# EAGLE schematic USB_to_MBUS (EAGLE 9.6.2)
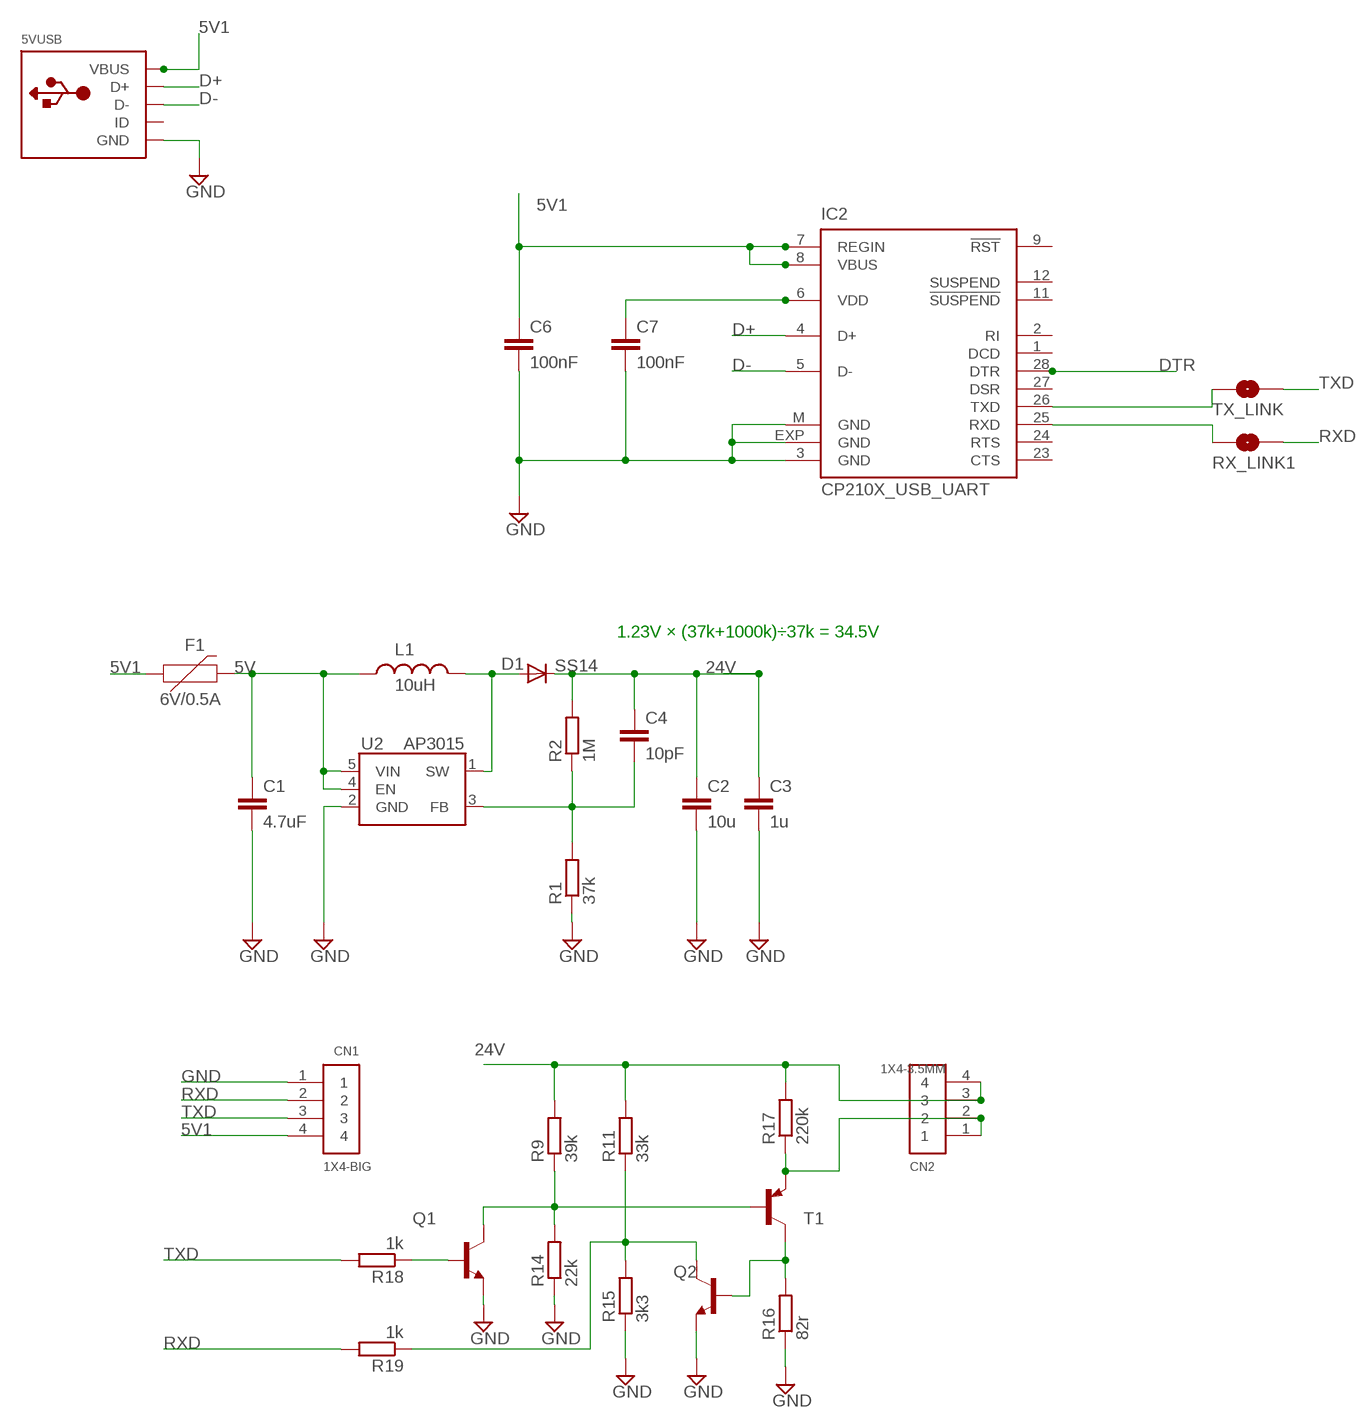
[diagram p0: schematic, sheet 1]

## Parts
5VUSB  USBMOLEX  [USB-MINIB-THM-MOLEX]
C1  4.7uF  1.0UF-0603-16V-10%  [0603]
C2  10u  1.0UF-1206-50V-10%  [1206]
C3  1u  1.0UF-1206-50V-10%  [1206]
C4  10pF  CAP0603-CAP  [0603-CAP]
C6  100nF  CAP0603-CAP  [0603-CAP]
C7  100nF  CAP0603-CAP  [0603-CAP]
CN1  1X4-BIG  [1X04-BIG]
CN2  1X4-3.5MM  [1X04-3.5MM]
D1  SS14  DIODESOD-123  [SOD-123]
F1  6V/0.5A  PPTC_HALF-AMP  [1206]
IC2  CP210X_USB_UART  [MLP28]
L1  10uH  INDUCTORCR54  [CR54]
Q1  BC808-NPN-SOT23-BEC  [SOT23-BEC]
Q2  BC808-NPN-SOT23-BEC  [SOT23-BEC]
R1  37k  R-EU_R0603  [R0603]
R2  1M  R-EU_R0603  [R0603]
R9  39k  R-EU_R0603  [R0603]
R11  33k  R-EU_R0603  [R0603]
R14  22k  R-EU_R0603  [R0603]
R15  3k3  R-EU_R0603  [R0603]
R16  82r  R-EU_R0603  [R0603]
R17  220k  R-EU_R0603  [R0603]
R18  1k  R-EU_R0603  [R0603]
R19  1k  R-EU_R0603  [R0603]
RX_LINK1  SOLDERJUMPERNC  [SJ_2S]
T1  BC807-16-PNP-SOT23-BEC  [SOT23-BEC]
TX_LINK  SOLDERJUMPERNC  [SJ_2S]
U2  AP3015  [SOT-23-5]

## Nets
5V: C1.1 F1.2 L1.P$1 U2.4(EN) U2.5(VIN)
5V1 [power]: 5VUSB.VBUS C6.1 CN1.4 F1.1 IC2.7(REGIN) IC2.8(VBUS)
24V: C2.1 C3.1 C4.1 CN2.3 CN2.4 D1.C R2.2 R9.2 R11.2 R17.2
D+: 5VUSB.D+ IC2.4(D+)
D-: 5VUSB.D- IC2.5(D-)
DTR: IC2.28(DTR)
GND [power]: 5VUSB.GND C1.2 C2.2 C3.2 C6.2 C7.2 CN1.1 IC2.3(GND) IC2.EXP(GND) IC2.M(GND) Q1.E Q2.E R1.1 R14.1 R15.1 R16.1 U2.2(GND)
N$1: C7.1 IC2.6(VDD)
N$4: C4.2 R1.2 R2.1 U2.3(FB)
N$5: D1.A L1.P$2 U2.1(SW)
N$10: IC2.26(TXD) TX_LINK.1
N$11: IC2.25(RXD) RX_LINK1.1
N$13: CN2.1 CN2.2 R17.1 T1.E
N$16: Q2.B R16.2 T1.C
N$18: Q1.C R9.1 R14.2 T1.B
N$21: Q2.C R11.1 R15.2 R19.1
N$25: Q1.B R18.1
RXD: CN1.2 R19.2 RX_LINK1.2
TXD: CN1.3 R18.2 TX_LINK.2
Unconnected: 5VUSB.ID IC2.1(DCD) IC2.2(RI) IC2.9(!RST) IC2.11(!SUSPEND) IC2.12(SUSPEND) IC2.23(CTS) IC2.24(RTS) IC2.27(DSR)

## Notes on the sheet
- 1.23V × (37k+1000k)÷37k = 34.5V

## Library data of the parts
5VUSB = adafruit:USB: USB Connectors USBMINIB - Surface Mount Female Mini-B USB Connector 4UConnector: 06564 By microbuilder.eu Thru-hole RA Female Mini-B USB Connector 4UConnector: 18732 By ladyada.net
C1 = SparkFun-Capacitors:1.0UF: 1µF ceramic capacitors A capacitor is a passive two-terminal electrical component used to store electrical energy temporarily in an electric field.; PROD_ID: CAP-00868; VALUE: 1.0uF
C2 C3 = SparkFun-Capacitors:1.0UF: 1µF ceramic capacitors A capacitor is a passive two-terminal electrical component used to store electrical energy temporarily in an electric field.; PROD_ID: CAP-09822; VALUE: 1.0uF
C4 C6 C7 = SparkFun:CAP: Capacitor Standard 0603 ceramic capacitor, and 0.1" leaded capacitor.
CN1 CN2 = adafruit:1X4: 4-pin connector
D1 = adafruit:DIODE: Diode SMADIODE - SMA Surface Mount Package 20V 1A Schottky Diode Digikey: 641-1014-6-ND DO-1N4148 - Through Hole Small Current Diode SOD-123 20V 1 A (.5mV Vf) Schottky Diode - Digikey: MBRX120TPMSCT-ND SOD-323 10V 570mA (.38mV Vf, 3ns) Schottky Diode - Digikey: ZLLS410CT-ND SOD-523 30V 30mA Schottky Diode (RB751S-40TE61) - Digikey: RB751S-40TE61CT-ND SOT23-R/W - SOT23 Package (R = Solder Paste/Reflow Ovens, W = Hand-Soldering) BAT54Film 40V 300mA - Digikey: 497-7162-1-ND
F1 = SparkFun-Fuses:PPTC: Resettable Fuse PPTC Resettable Fuse. Really a sort of resistor with a polymeric positive temperature coefficient whose resistance increases dramatically with an increase in temperature. When heated by the power passing through the resistance rises causing the current to be limited, protecting the circuit. This is achieved by the transition of the polymer from a crystalline to an amorphous state where the conductive carbon separates breaking the conductive pathways found in the cool crystalline structure. When a PPTC cools back down it resumes conducting letting the circuit turn back on. SparkFun Products: SparkFun RedBoard - Programmed with Arduino <https://www.sparkfun.com/products/12757> Pro Micro - 5V/16MHz <https://www.sparkfun.com/products/12640> Arduino Pro 328 - 5V/16MHz <https://www.sparkfun.com/products/10915> MP3 Trigger <https://www.sparkfun.com/products/13720>; PROD_ID: RES-08585
IC2 = SparkFun-DigitalIC:CP210X_USB_UART: Single-Chip USB to UART Bridge Source: www.silabs.com .. CP2101.pdf / cp2102.pdf. Spark Fun Electronics SKU : COM-00310
L1 = SparkFun:INDUCTOR: Inductors Basic Inductor/Choke - 0603 and 1206. Footprints are not proven and vary greatly between part numbers.
Q1 Q2 = transistor:*-NPN-: NPN Transistror BF959 corrected 2008.03.06
R1 R2 R9 R11 R14-R19 = rcl:R-EU_: RESISTOR, European symbol
RX_LINK1 TX_LINK = SparkFun:SOLDERJUMPER: Solder Jumper Standard SMD solder jumper. Used to automate production. Two varients : Normally Open and Normally Closed are the same, but have different paste layers. NC will have a large amount of paste and should jumper during reflow.
T1 = transistor:*-PNP-: PNP Transistror
U2 = dword1511-pmic-dcdc:AP3015: Micro-power Step-up DC-DC Converter

## Net classes
0 default: width 0.203 mm, drill 0.6 mm, clearance 0.203 mm
1 power: width 0.381 mm, drill 0.6 mm, clearance 0.254 mm
2 gnd: width 0.254 mm, drill 0.6 mm, clearance 0.254 mm
3 thin_power2: width 0.254 mm, clearance 0.254 mm